# EAGLE design esp-oled-thing (EAGLE 6.2)
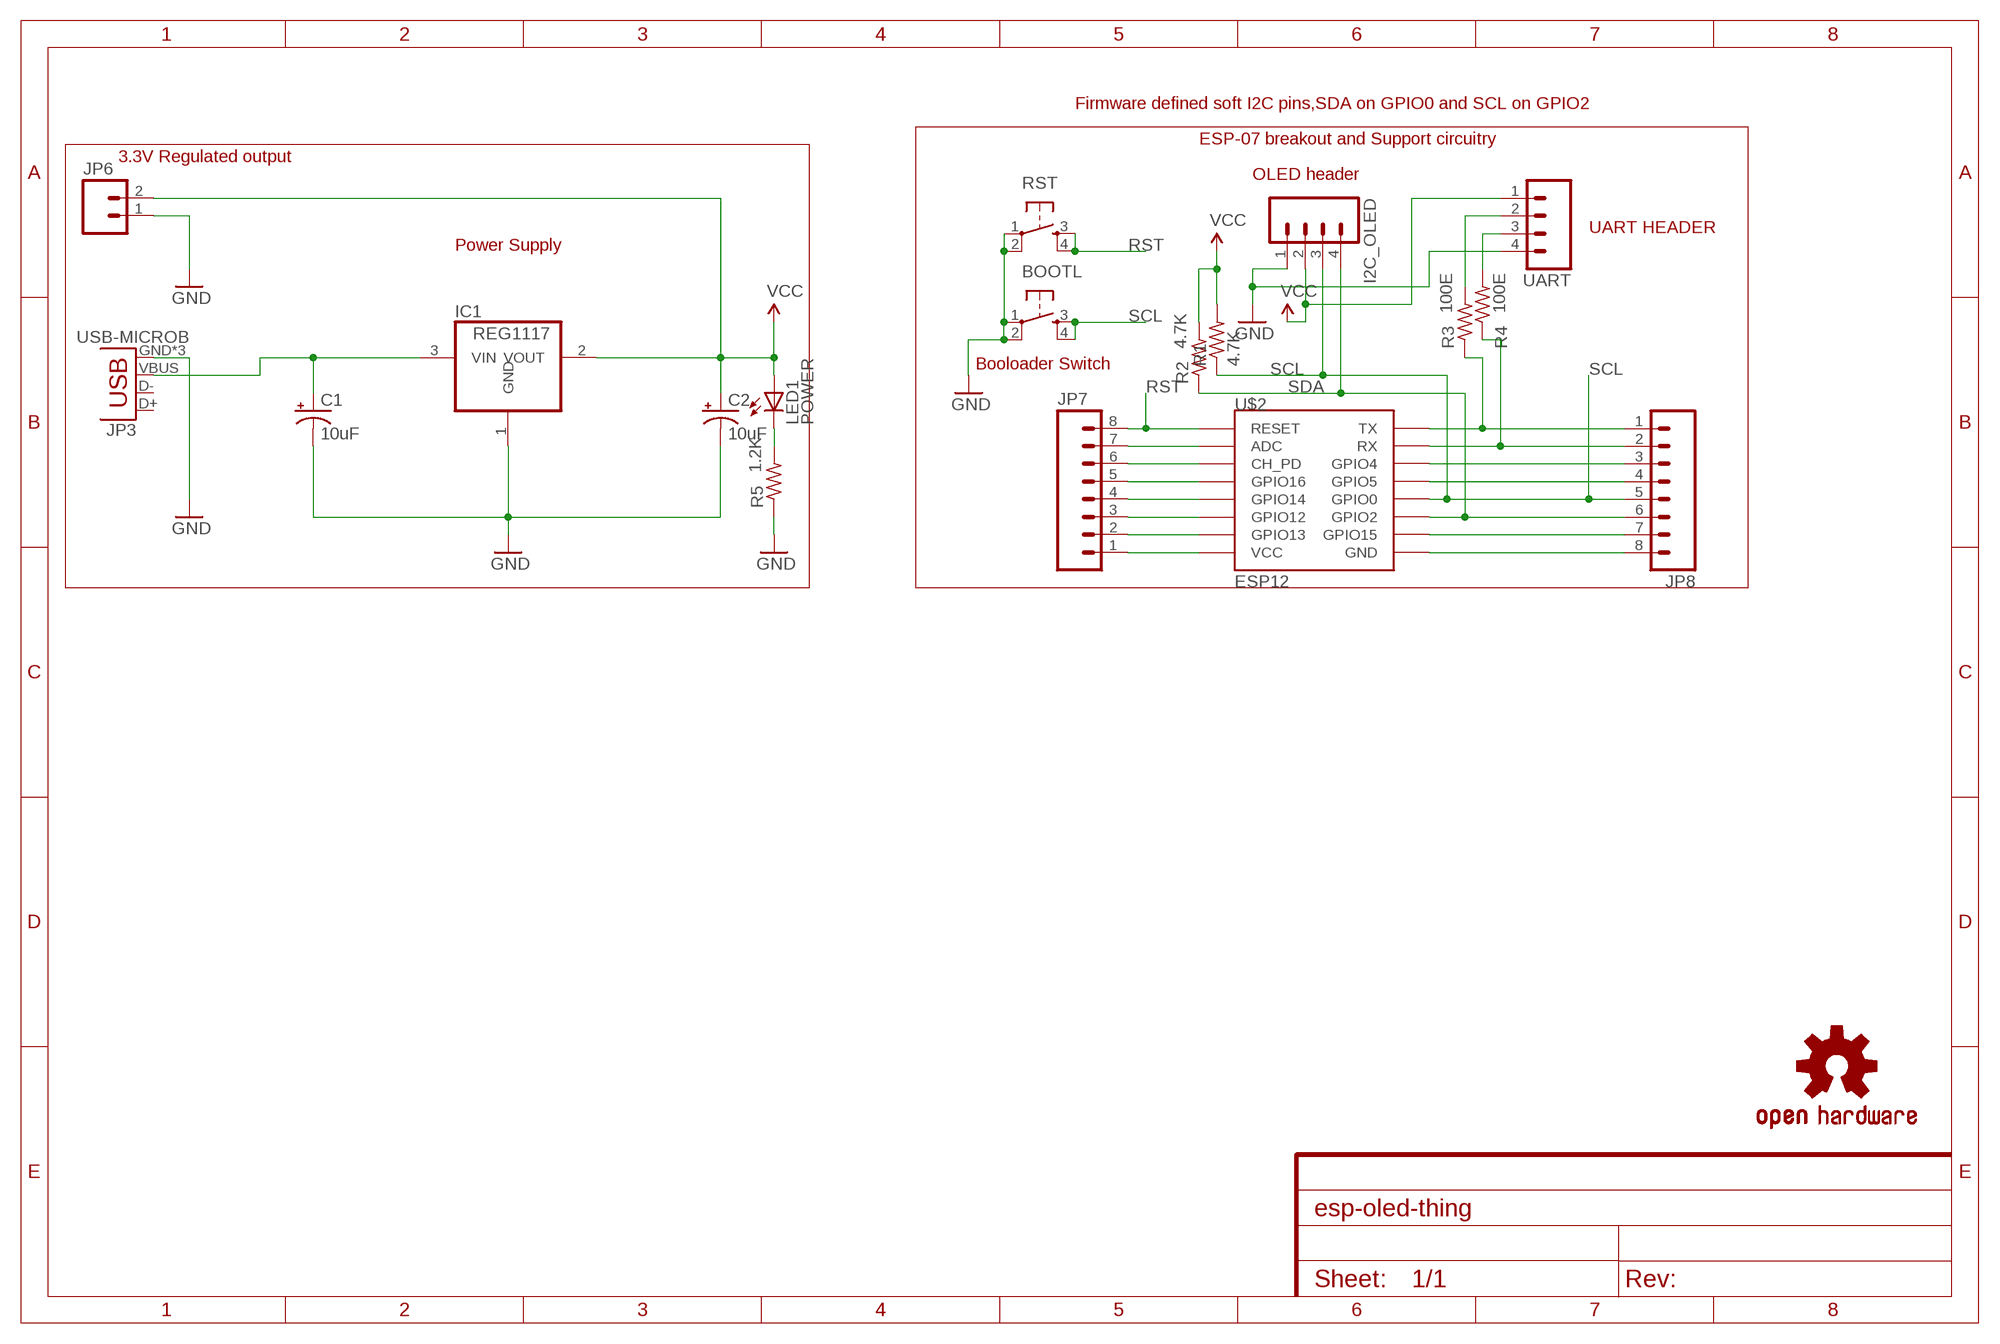
[diagram p0: schematic, sheet 1]

## Parts
BOOTL  TAC_SWITCHSMD  [TACTILE_SWITCH_SMD]
C1  10uF  10UF-16V-10%(TANT)  [EIA3216]
C2  10uF  10UF-16V-10%(TANT)  [EIA3216]
I2C_OLED  M04PTH  [1X04]
IC1  REG1117  [SOT223]
JP3  USB-MICROB  [USB-MICROB]
JP6  M02JST-PTH-2  [JST-2-PTH]
JP7  M081X08  [1X08]
JP8  M081X08  [1X08]
LED1  POWER  LEDCHIPLED_0805  [CHIPLED_0805]
R1  4.7K  R-US_M0805  [M0805]
R2  4.7K  R-US_M0805  [M0805]
R3  100E  R-US_M0805  [M0805]
R4  100E  R-US_M0805  [M0805]
R5  1.2K  R-US_M0805  [M0805]
RST  TAC_SWITCHSMD  [TACTILE_SWITCH_SMD]
U$1  OSHW-LOGOS  [OSHW-LOGO-S]
U$2  ESP12  [ESP12]
UART  M04LONGPADS  [1X04_LONGPADS]

## Nets
GND: BOOTL.1 BOOTL.2 C1.C(-) C2.C(-) I2C_OLED.1 IC1.1(GND) JP3.GND JP3.MT1(GND) JP3.MT2(GND) JP6.1 R5.1 RST.1 RST.2 UART.4
N$1: C1.A(+) IC1.3(VIN) JP3.VBUS
N$2: JP7.1 U$2.VCC
N$3: JP7.7 U$2.ADC
N$4: R3.2 UART.2
N$5: JP7.5 U$2.GPIO16
N$6: JP7.4 U$2.GPIO14
N$7: JP7.3 U$2.GPIO12
N$8: R4.2 UART.3
N$9: JP7.2 U$2.GPIO13
N$10: LED1.C R5.2
N$11: JP8.3 U$2.GPIO4
N$12: JP8.4 U$2.GPIO5
N$15: JP8.7 U$2.GPIO15
N$16: JP8.8 U$2.GND
N$17: JP7.6 U$2.CH_PD
N$19: JP8.1 R3.1 U$2.TX
N$20: JP8.2 R4.1 U$2.RX
RST: JP7.8 RST.3 RST.4 U$2.RESET
SCL: BOOTL.3 BOOTL.4 I2C_OLED.3 JP8.5 R1.1 U$2.GPIO0
SDA: I2C_OLED.4 JP8.6 R2.1 U$2.GPIO2
VCC: C2.A(+) I2C_OLED.2 IC1.2(VOUT) JP6.2 LED1.A R1.2 R2.2 UART.1
Unconnected: JP3.D+ JP3.D-

## Notes on the sheet
- Firmware defined soft I2C pins,SDA on GPIO0 and SCL on GPIO2
- ESP-07 breakout and Support circuitry
- 3.3V Regulated output
- OLED header
- UART HEADER
- Power Supply
- Booloader Switch

## Library data of the parts
BOOTL RST = SparkFun:TAC_SWITCH: Momentary Switch Button commonly used for reset or general input. Spark Fun Electronics SKU : COM-00097
C1 C2 = SparkFun-Capacitors:10UF-16V-10%(TANT): CAP-00811 1206/EIA-3216 Tantalum capacitor; PROD_ID: CAP-00811
I2C_OLED UART = SparkFun:M04: Header 4 Standard 4-pin 0.1" header. Use with straight break away headers (SKU : PRT-00116), right angle break away headers (PRT-00553), swiss pins (PRT-00743), machine pins (PRT-00117), and female headers (PRT-00115). Molex polarized connector foot print use with SKU : PRT-08231 with associated crimp pins and housings. 1MM SMD Version SKU: PRT-10208
IC1 = burr-brown:REG1117: 800mA and 1A Low Dropout (LDO) Positive Regulator 1.8V, 2.5V, 2.85V, 3.3V, 5V, and Adj; MPN: REG1117; OC_FARNELL: 1097566; OC_NEWARK: 14P6981
JP3 = SparkFun-Connectors:USB: USB Connectors USB-B-PTH is fully proven SKU : PRT-00139/CONN-08278 USB-miniB is fully proven SKU : PRT-00587 USB-A-PCB is untested. USB-A-H is throughly reviewed, but untested. Spark Fun Electronics SKU : PRT-00437 USB-B-SMT is throughly reviewed, but untested. Needs silkscreen touching up. USB-A-S has not been used/tested USB-MB-H has not been used/tested USB-MICROB has been used. CONN-09505; PROD_ID: CONN-09505
JP6 = SparkFun:M02: Header 2 Standard 2-pin 0.1" header. Use with straight break away headers (SKU : PRT-00116), right angle break away headers (PRT-00553), swiss pins (PRT-00743), machine pins (PRT-00117), and female headers (PRT-00115). Molex polarized connector foot print use with SKU : PRT-08233 with associated crimp pins and housings.
JP7 JP8 = SparkFun:M08: Header 8 Standard 8-pin 0.1" header. Use with straight break away headers (SKU : PRT-00116), right angle break away headers (PRT-00553), swiss pins (PRT-00743), machine pins (PRT-00117), and female headers (PRT-00115).
LED1 = adafruit:LED: LED OSRAM: - CHIPLED LG R971, LG N971, LY N971, LG Q971, LY Q971, LO R971, LY R971 LH N974, LH R974 LS Q976, LO Q976, LY Q976 LO Q996 - Hyper CHIPLED LW Q18S LB Q993, LB Q99A, LB R99A - SideLED LS A670, LO A670, LY A670, LG A670, LP A670 LB A673, LV A673, LT A673, LW A673 LH A674 LY A675 LS A676, LA A676, LO A676, LY A676, LW A676 LS A679, LY A679, LG A679 - Hyper Micro SIDELED® LS Y876, LA Y876, LO Y876, LY Y876 LT Y87S - SmartLED LW L88C, LW L88S LB L89C, LB L89S, LG L890 LS L89K, LO L89K, LY L89K LS L896, LA L896, LO L896, LY L896 - TOPLED LS T670, LO T670, LY T670, LG T670, LP T670 LSG T670, LSP T670, LSY T670, LOP T670, LYG T670 LG T671, LOG T671, LSG T671 LB T673, LV T673, LT T673, LW T673 LH T674 LS T676, LA T676, LO T676, LY T676, LB T676, LH T676, LSB T676, LW T676 LB T67C, LV T67C, LT T67C, LS T67K, LO T67K, LY T67K, LW E67C LS E67B, LA E67B, LO E67B, LY E67B, LB E67C, LV E67C, LT E67C LW T67C LS T679, LY T679, LG T679 LS T770, LO T770, LY T770, LG T770, LP T770 LB T773, LV T773, LT T773, LW T773 LH T774 LS E675, LA E675, LY E675, LS T675 LS T776, LA T776, LO T776, LY T776, LB T776 LHGB T686 LT T68C, LB T68C - Hyper Mini TOPLED® LB M676 - Mini TOPLED Santana® LG M470 LS M47K, LO M47K, LY M47K Source: http://www.osram.convergy.de/
R1-R5 = adafruit:R-US_: RESISTOR, American symbol
U$1 = SparkFun:OSHW-LOGO: Open Source Hardware Logo This logo indicates the piece of hardware it is found on incorporates a OSHW license and/or adheres to the definition of open source hardware found here: http://freedomdefined.org/OSHW
U$2 = esp8266modules:ESP12: ESP8266 Wifi module 12

## Board
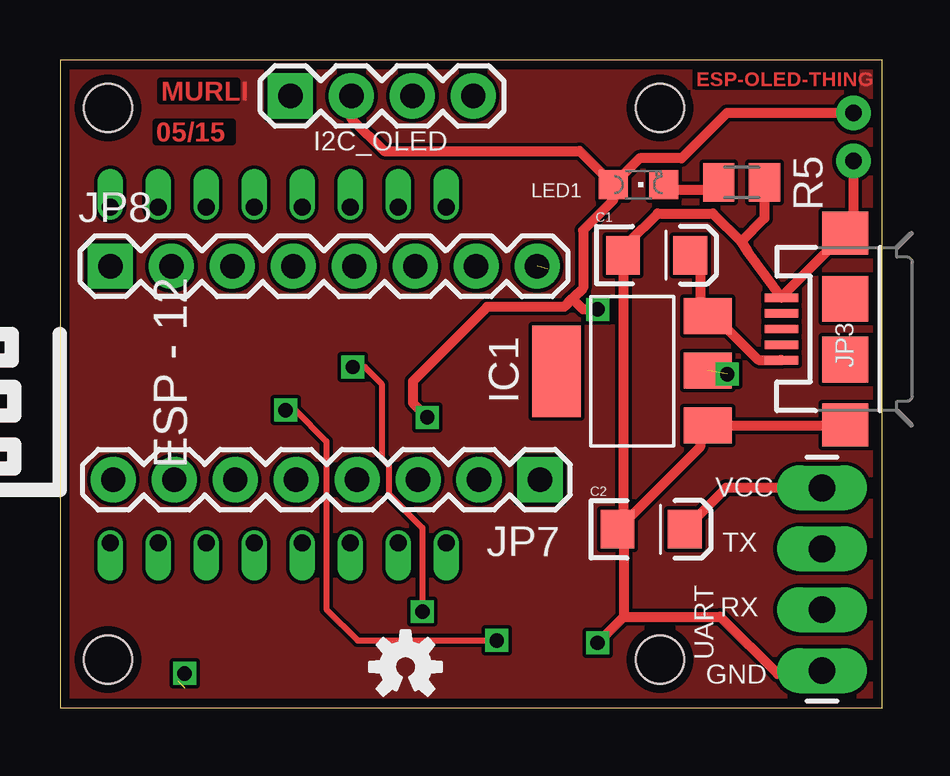
[diagram p1: board, top side]
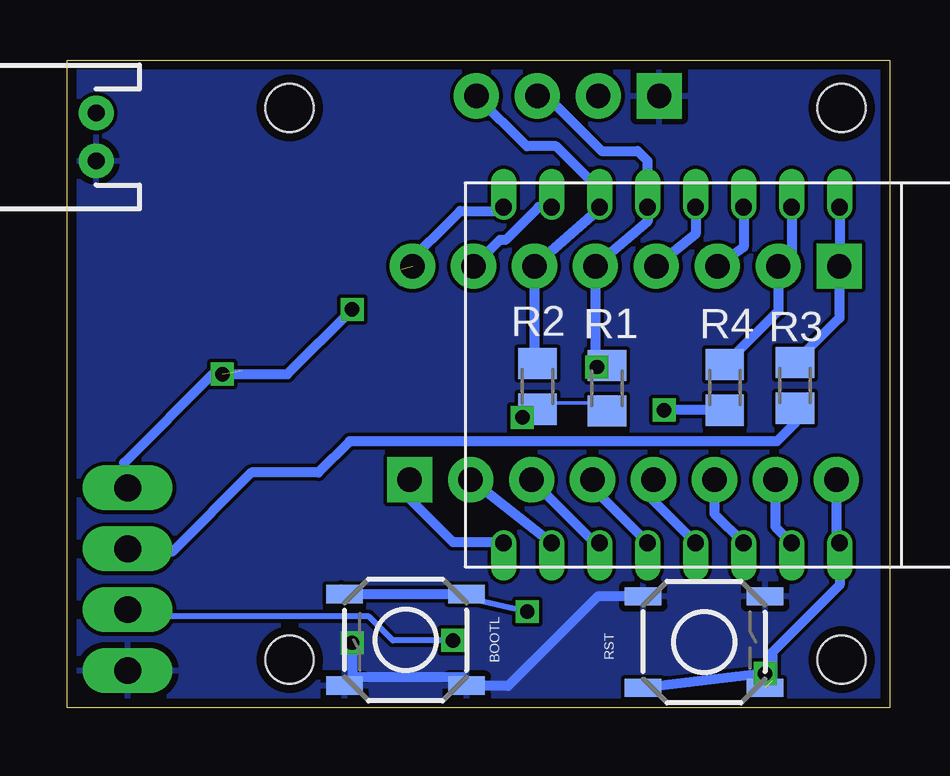
[diagram p2: board, bottom side, seen from below]

Size 34.27 x 27 mm. Coordinates in mm from the lower left corner, seen from the top.
Outline: 0,0 34.27,0 34.27,27 0,27 0,0
Copper layers (1*16): Top 0.0356mm / dielectric 1.5011mm / Bottom 0.0356mm
Design rules: minimum track width 6mil, minimum drill 13mil, track to track 6mil, track to pad 6mil, pad to pad 6mil, via to via 6mil, smd to smd 6mil, copper to edge 15mil, drill to drill 6mil, minimum pad ring 7mil, minimum via ring 7mil, stop-mask expansion 3mil, vias tented up to drill 0mil, thermal gap 10mil
Holes 2 mm at 2,25 2,2 25,2 25,25

### Footprints (pad centres in the part's own frame; a part is rotated, then mirrored left to right if it is on the bottom)
TACTILE_SWITCH_SMD = smd 1.524 x 0.762: 1 -2.54,1.905; 2 2.54,1.905; 3 -2.54,-1.905; 4 2.54,-1.905
EIA3216 = smd 1.4 x 1.6: A 1.4,0; C -1.4,0
1X04 = drill 1.016 pad 1.88 square: 1 0,0 | drill 1.016 pad 1.88: 2 2.54,0; 3 5.08,0; 4 7.62,0
SOT223 = smd 1.499 x 2.007: 1 -2.261,-3.15; 2 0.025,-3.15; 3 2.311,-3.15 | smd 3.81 x 2.007: 4 0,3.15
USB-MICROB = smd 0.35 x 1.4: D+ 0,2.65; D- -0.65,2.65; GND 1.3,2.65; ID 0.65,2.65; VBUS -1.3,2.65 | smd 1.8 x 1.9: MT1 -4,0; MT2 4,0 | smd 1.9 x 1.9: P$1 -1.27,0; P$2 1.27,0
JST-2-PTH = drill 0.7 pad 1.448: 1 -1,0; 2 1,0
1X08 = drill 1.016 pad 1.88 square: 1 0,0 | drill 1.016 pad 1.88: 2 2.54,0; 3 5.08,0; 4 7.62,0; 5 10.16,0; 6 12.7,0; 7 15.24,0; 8 17.78,0
CHIPLED_0805 = smd 1.2 x 1.2: A 0,-1.05; C 0,1.05
M0805 = smd 1.3 x 1.6: 1 -0.95,0; 2 0.95,0
ESP12 = drill 0.7 offset: ADC -7.1,3.8; CH_PD -7.1,1.8; GND 6.9,-8.2; GPIO0 6.9,-2.2; GPIO2 6.9,-4.2; GPIO4 6.9,1.8; GPIO5 6.9,-0.2; GPIO12 -7.1,-4.2; GPIO13 -7.1,-6.2; GPIO14 -7.1,-2.2; GPIO15 6.9,-6.2; GPIO16 -7.1,-0.2; RESET -7.1,5.8; RX 6.9,3.8; TX 6.9,5.8; VCC -7.1,-8.2
1X04_LONGPADS = drill 1.118 pad 1.88 long: 1 0,0; 2 2.54,0; 3 5.08,0; 4 7.62,0

### Placement (x,y rotation side)
BOOTL  20.17,2.82 180 bottom
C1  24.86,18.86 0 top
C2  24.63,7.43 0 top
I2C_OLED  9.6,25.5 0 top
IC1  23.84,14.02 90 top
JP3  32.72,15.78 90 top
JP6  33.06,23.79 90 bottom
JP7  20,9.5 180 top
JP8  2.1,18.4 0 top
LED1  24.1,21.8 270 top
R1  11.77,13.31 270 bottom
R2  14.67,13.39 270 bottom
R3  3.95,13.43 270 bottom
R4  6.87,13.35 270 bottom
R5  28.4,21.9 180 top
RST  7.73,2.73 0 bottom
U$1  14.4,1.7 0 top
U$2  7.89,13.97 90 top
UART  31.75,9.16 270 top

### Tracks (layer width: path | path; a pad name or v marks a point on that pad's centre or on a via)
GND  (via drill 0.6)
  Top 0.152: 26.67,11.43 IC1.1 | 23.49,6.99 22.86,7.62 C2.C | 33.02,20.32 JP3.MT2 | 31.75,1.27 UART.4
  Top 0.406: 26.67,11.43 26.67,10.87 C2.C | R5.1 29.35,20.4 28.38,19.43 | 28.38,19.43 28.65,19 JP3.GND 30.07,17.13 JP3.MT2 33.06,20.12 JP6.1 | 23.49,3.79 23.49,6.99 23.46,7.02 C1.C 23.7,19.1 23.7,19.4 24.9,20.6 27.2,20.6 28.38,19.43 | 23.49,3.79 v22.4,2.7 | 23.49,3.79 27.51,3.79 29.9,1.4 31.61,1.4 UART.4 | IC1.1 32.7,11.76 JP3.MT1
  Bottom 0.152: 17.78,1.27 BOOTL.1
  Bottom 0.406: RST.1 12.16,4.63 15.9,0.9 17.61,0.9 BOOTL.1 | 17.78,1.27 22.36,1.27 BOOTL.2 22.4,1.23 v22.4,2.7
  pour Bottom: 0,27 34.3,27 34.3,0 0,0
N$1
  Top 0.152: 26.67,19.05 C1.A | 26.67,16.51 IC1.3
  Top 0.406: JP3.VBUS 30.05,14.5 29.1,14.5 27.27,16.33 IC1.3 26.67,16.65 26.67,19.05
N$2
  Bottom 0.406: JP7.1 20,8.7 18.2,6.9 16.12,6.9 U$2.VCC
N$3
  Bottom 0.406: JP7.7 4.76,7.54 U$2.ADC
N$4
  Bottom 0.406: R3.2 3.95,11.85 4.7,11.1 22.5,11.1 23.8,9.8 26.6,9.8 29.9,6.5 31.63,6.5 UART.2
N$5
  Bottom 0.406: JP7.5 9.84,8.62 U$2.GPIO16
N$6
  Bottom 0.406: JP7.4 12.38,9.16 U$2.GPIO14
N$7
  Bottom 0.406: U$2.GPIO12 12.29,6.87 JP7.3
N$8  (via drill 0.6)
  Top 0.254: v9.4,12.4 9.8,12.4 11.1,11.1 11.1,4.1 12.4,2.8 v18.2,2.8
  Bottom 0.254: v18.2,2.8 20.7,2.8 21.7,3.8 31.47,3.8 UART.3
  Bottom 0.406: R4.2 v9.4,12.4
N$9
  Bottom 0.406: JP7.2 17.42,9.5 U$2.GPIO13
N$10
  Top 0.152: 25.4,21.59 LED1.C
  Top 0.406: 25.4,21.59 27.14,21.59 R5.2
N$11
  Bottom 0.406: U$2.GPIO4 6.09,19.19 JP8.3
N$12
  Bottom 0.406: U$2.GPIO5 8.09,19.73 JP8.4
N$13
  pour Top: 0,27 34,27 34,0 0,0
N$15
  Bottom 0.406: U$2.GPIO15 14.63,20.87 16,19.5 16.24,19.5 JP8.7
N$16  (1 unrouted)
  Bottom 0.406: 20.32,17.78 20.32,18.28 17.9,20.7 16.26,20.7 U$2.GND
N$17
  Bottom 0.406: JP7.6 7.3,8.08 U$2.CH_PD
N$19
  Bottom 0.406: U$2.TX 2.09,18.11 JP8.1 2.1,16.23 R3.1
N$20
  Bottom 0.406: U$2.RX 4.09,18.65 JP8.2 4.64,16.53 R4.1
RST  (via drill 0.6)  (1 unrouted)
  Bottom 0.406: RST.3 v5.19,1.43 4.9,1.11 4.9,2.3 2.09,5.11 U$2.RESET 2.22,7 JP7.8
SCL  (via drill 0.6)
  Top 0.254: v12.2,14.2 12.7,14.2 13.4,13.5 13.4,10.4 13.7,10.1 13.7,8.9 15.1,7.5 v15.1,4
  Bottom 0.152: 22.86,5.08 BOOTL.4
  Bottom 0.254: R1.1 12.14,14.26 v12.2,14.2 | v15.1,4 18.18,4.7 18.2,4.72
  Bottom 0.406: R1.1 12.26,14.75 JP8.5 10.09,20.27 U$2.GPIO0 10.1,22.8 10.5,23.2 12,23.2 14.2,25.4 14.58,25.4 | 14.58,25.4 I2C_OLED.3 | 14.58,25.4 14.8,25.4 | BOOTL.3 18.2,4.72 BOOTL.4
SDA
  Bottom 0.406: R2.1 14.8,14.47 JP8.6 12.09,20.81 U$2.GPIO2 12.09,21.59 13.9,23.4 15.12,23.4 I2C_OLED.4
VCC  (via drill 0.6)  (1 unrouted)
  Top 0.152: 26.67,7.62 C2.A
  Top 0.406: I2C_OLED.2 12.14,24.56 13.5,23.2 21.65,23.2 LED1.A | LED1.A 23.05,21.15 21.8,19.9 21.8,17.5 21.35,17.05 | 21.35,17.05 21,16.7 17.8,16.7 14.7,13.6 14.7,12.7 v15.3,12.1 | JP6.2 27.79,24.79 25.9,22.9 24.15,22.9 LED1.A | 27.94,13.97 27.87,13.97 v27.8,13.9 | UART.1 27.76,9.16 C2.A | v22.4,16.6 21.8,16.6 21.35,17.05
  Bottom 0.152: R1.2 11.43,12.7 13.97,12.7 R2.2 | 33.02,25.4 JP6.2
  Bottom 0.406: v15.3,12.1 15.01,12.1 R2.2 | UART.1 31.9,9.31 31.9,10.2 28.2,13.9 v27.8,13.9 25.1,13.9 v22.4,16.6

### Text on the board
Top: ESP-OLED-THING | MURLI | 05/15
tNames: VCC | TX | RX | GND